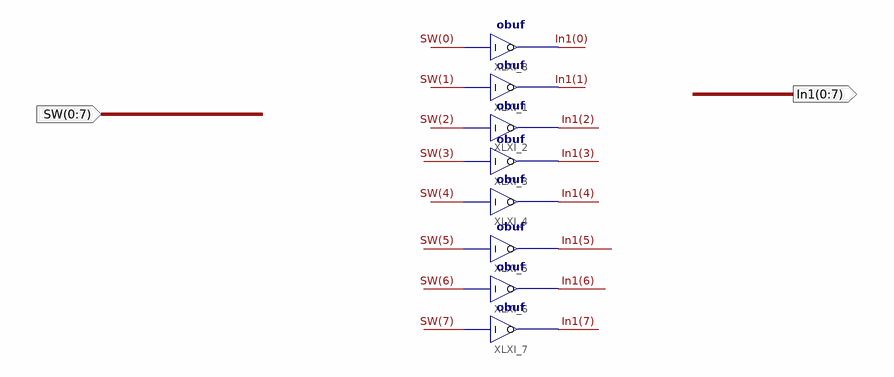
[diagram p0: schematic sheet 1]
// Xilinx ISE schematic input1.sch (spartan6) as structural Verilog: 8 symbols, 2 ports
module input1 (
  input  [0:7] SW,
  output [0:7] In1
);

  obuf XLXI_1 (.I(SW[1]), .O(In1[1]));
  obuf XLXI_2 (.I(SW[2]), .O(In1[2]));
  obuf XLXI_3 (.I(SW[3]), .O(In1[3]));
  obuf XLXI_4 (.I(SW[4]), .O(In1[4]));
  obuf XLXI_5 (.I(SW[5]), .O(In1[5]));
  obuf XLXI_6 (.I(SW[6]), .O(In1[6]));
  obuf XLXI_7 (.I(SW[7]), .O(In1[7]));
  obuf XLXI_8 (.I(SW[0]), .O(In1[0]));
endmodule
